# Altium schematic sheet Brightside_Telemetry_power_rev2.SchDoc
size A4
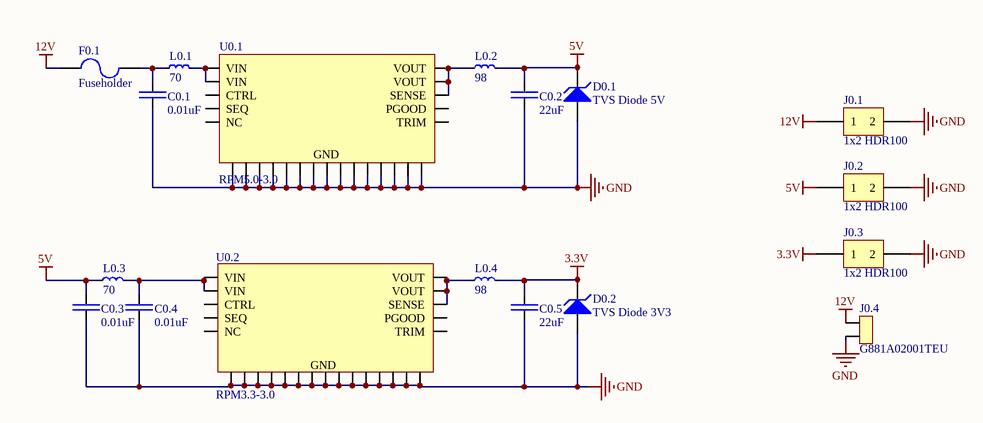
[diagram p0: Brightside_Telemetry_power_rev2.SchDoc]

## Parts
C0.1  0.01uF  [0805]
C0.2  22uF  [1206]
C0.3  0.01uF  [0805]
C0.4  0.01uF  [0805]
C0.5  22uF  [1206]
D0.1  TVS Diode 5V  [SOD-323]
D0.2  TVS Diode 3V3  [SOD-323]
F0.1  Fuseholder  [SCHURTER - 0031.7701.11 - FUSE HOLDER, PCB MOUNT]
J0.1  1x2 HDR100  [Molex 0901200762]
J0.2  1x2 HDR100  [Molex 0901200762]
J0.3  1x2 HDR100  [Molex 0901200762]
J0.4  G881A02001TEU  [Micro-Fit 3.0 2pos]
L0.1  70  [1812]
L0.2  98  [7427932]
L0.3  70  [1812]
L0.4  98  [7427932]
U0.1  RPM5.0-3.0  [25-BLGA]
U0.2  RPM3.3-3.0  [25-BLGA]

## Nets
3.3V: C0.5.2 D0.2.2(K) J0.3.1 L0.4.2
5V: C0.2.2 C0.3.2 D0.1.2(K) J0.2.1 L0.2.2 L0.3.1
12V: F0.1.1 J0.1.1 J0.4.1
GND: C0.1.1 C0.2.1 C0.3.1 C0.4.1 C0.5.1 D0.1.1(A) D0.2.1(A) J0.1.2 J0.2.2 J0.3.2 J0.4.2 U0.1.A3(GND) U0.1.A4(GND) U0.1.B1(GND) U0.1.B2(GND) U0.1.B3(GND) U0.1.B4(GND) U0.1.C2(GND) U0.1.C3(GND) U0.1.C4(GND) U0.1.D2(GND) U0.1.D3(GND) U0.1.D4(GND) U0.1.D5(GND) U0.1.E3(GND) U0.1.E4(GND) U0.2.A3(GND) U0.2.A4(GND) U0.2.B1(GND) U0.2.B2(GND) U0.2.B3(GND) U0.2.B4(GND) U0.2.C2(GND) U0.2.C3(GND) U0.2.C4(GND) U0.2.D2(GND) U0.2.D3(GND) U0.2.D4(GND) U0.2.D5(GND) U0.2.E3(GND) U0.2.E4(GND)
NetC0.1_2: C0.1.2 F0.1.2 L0.1.1
NetC0.4_2: C0.4.2 L0.3.2 U0.2.A1(VIN) U0.2.A2(VIN)
NetL0.1_2: L0.1.2 U0.1.A1(VIN) U0.1.A2(VIN)
NetL0.2_1: L0.2.1 U0.1.A5(VOUT) U0.1.B5(VOUT) U0.1.C5(SENSE)
NetL0.4_1: L0.4.1 U0.2.A5(VOUT) U0.2.B5(VOUT) U0.2.C5(SENSE)

Not connected (* = marked no-connect by the designer): U0.1 C1(CTRL) D1(PGOOD) E1(SEQ) E2(NC) E5(TRIM); U0.2 C1(CTRL) D1(PGOOD) E1(SEQ) E2(NC) E5(TRIM)

## Library data of the parts
C0.1 C0.3 C0.4 = C0805C103K1RAC7210: Cap Ceramic 0.01uF 100V X7R 10% SMD 0805 125C T/R; Manufacturer: KEMET; Capacitance: 10nF; Supplier 1: Digi-Key; Supplier Part Number 1: 399-17617-1-ND; Manufacturer Part Number: C0805C103K1RAC7210; RoHS: Yes; Category: Ceramic Capacitors; Stock 1: 43378; Mount: Surface Mount; Case/Package: 0805; Case Code (Imperial): 0805; Case Code (Metric): 2012; Dielectric Material: Ceramic; Min Operating Temperature: -55°C; Max Operating Temperature: 125°C; Dielectric: X7R; Tolerance: 10%; Termination: SMD/SMT; Packaging: Tape and Reel; Package Quantity: 10000; Voltage Rating: 100V; Voltage Rating (DC): 100V; Length: 2mm; Height: 0.78mm; Depth: 1.25mm; Radiation Hardening: No; ComponentLink1URL: http://www.mouser.com/ds/2/212/KEM_C1002_X7R_SMD-1102033.pdf?src-supplier=Mouser; ComponentLink1Description: http://www.mouser.com/ds/2/212/KEM_C1002_X7R_SMD-1102033.pdf?src-supplier=Mouser; ComponentLink2URL: https://www.verical.com/server-webapp/html/getDatasheet?partID=131027&src-supplier=Verical; ComponentLink2Description: https://www.verical.com/server-webapp/html/getDatasheet?partID=131027&src-supplier=Verical; ComponentLink3URL: http://components.arrow.com/part/dataview/0323_00324583?src-supplier=Arrow+Europe; ComponentLink3Description: http://components.arrow.com/part/dataview/0323_00324583?src-supplier=Arrow+Europe; ComponentLink4URL: http://www.farnell.com/datasheets/2747800.pdf?src-supplier=Farnell; ComponentLink4Description: http://www.farnell.com/datasheets/2747800.pdf?src-supplier=Farnell; ComponentLink5URL: http://components.arrow.com/part/dataview/2091052S6675795N7429?src-supplier=Arrow; ComponentLink5Description: http://components.arrow.com/part/dataview/2091052S6675795N7429?src-supplier=Arrow; ComponentLink6URL: http://www.farnell.com/datasheets/2747800.pdf?src-supplier=Newark; ComponentLink6Description: http://www.farnell.com/datasheets/2747800.pdf?src-supplier=Newark; ComponentLink7URL: http://www.kemet.com/kemet/web/homepage/kechome.nsf/weben/C4DA2DA1D1C9D3C3CA2570A50016092D/$file/KEM_C1002_X7R_SMD.pdf?src-supplier=Avnet+Europe; ComponentLink7Description: http://www.kemet.com/kemet/web/homepage/kechome.nsf/weben/C4DA2DA1D1C9D3C3CA2570A50016092D/$file/KEM_C1002_X7R_SMD.pdf?src-supplier=Avnet+Europe; ComponentLink8URL: http://www.kemet.com/kemet/web/homepage/kechome.nsf/weben/C4DA2DA1D1C9D3C3CA2570A50016092D/$file/KEM_C1002_X7R_SMD.pdf?src-supplier=Avnet; ComponentLink8Description: http://www.kemet.com/kemet/web/homepage/kechome.nsf/weben/C4DA2DA1D1C9D3C3CA2570A50016092D/$file/KEM_C1002_X7R_SMD.pdf?src-supplier=Avnet; ComponentLink9URL: https://api.kemet.com/component-edge/download/datasheet/C0805C103K1RAC7210.pdf?src-supplier=Digi-Key; ComponentLink9Description: https://api.kemet.com/component-edge/download/datasheet/C0805C103K1RAC7210.pdf?src-supplier=Digi-Key
C0.2 C0.5 = CL31B226KPHNNNE: CAP CER 22UF 10V X7R 1206; Manufacturer: Samsung; Tolerance: 10%; Supplier 1: Digi-Key; Supplier Part Number 1: 1276-2769-1-ND; Manufacturer Part Number: CL31B226KPHNNNE; RoHS: Yes; Category: Ceramic Capacitors; Stock 1: 617814; Mount: Surface Mount; Case/Package: 1206; Case Code (Metric): 3216; Case Code (Imperial): 1206; Contact Plating: Tin; Min Operating Temperature: -55°C; Max Operating Temperature: 125°C; Package Quantity: 2000; Packaging: Tape and Reel; Capacitance: 22uF; Voltage Rating: 10V; Dielectric: X7R; Voltage Rating (DC): 10V; Termination: Wraparound; Length: 3.2mm; Thickness: 0.071inch; Width: 0.063inch; Depth: 1.6mm; Radiation Hardening: No; Lead Free: Lead Free; ComponentLink1URL: https://datasheet.ciiva.com/25724/cl31b226kphnnne-25724443.pdf?src-supplier=Digi-Key; ComponentLink1Description: https://datasheet.ciiva.com/25724/cl31b226kphnnne-25724443.pdf?src-supplier=Digi-Key; ComponentLink2URL: https://datasheet.ciiva.com/16384/cl31b226kphnnne-16384588.pdf?src-supplier=Future+Electronics; ComponentLink2Description: https://datasheet.ciiva.com/16384/cl31b226kphnnne-16384588.pdf?src-supplier=Future+Electronics; ComponentLink3URL: https://datasheet.ciiva.com/26838/getdatasheetpartid-710483-26838941.pdf?src-supplier=Verical; ComponentLink3Description: https://datasheet.ciiva.com/26838/getdatasheetpartid-710483-26838941.pdf?src-supplier=Verical
D0.1 = SD05T1G: TVS DIODE 5V 9.8V SOD323; Manufacturer: ON Semiconductor; Capacitance: 350pF; Direction: Unidirectional; Clamping Voltage: 14.5V; Peak Pulse Power: 350W; Number of Unidirectional Channels: 1; Min Breakdown Voltage: 6.2V; Power Line Protection: No; Peak Pulse Current: 24A; Element Configuration: Single; Breakdown Voltage: 6.75V; Leakage Current: 10uA; Max Breakdown Voltage: 7.3V; Test Current: 1mA; ESD Protection: Yes; Max Power Dissipation: 200mW; Supplier 1: Digi-Key; Supplier Part Number 1: SD05T1GOSCT-ND; Manufacturer Part Number: SD05T1G; Stock 1: 61559; Pricing 1: 1 = 0.49000, 10 = 0.36500, 100 = 0.20680, 500 = 0.13698, 1000 = 0.10502 (USD); RoHS: Yes; Case/Package: SOD-323-2; Number of Pins: 2; Contact Plating: Tin; Min Operating Temperature: -55°C; Max Operating Temperature: 150°C; Packaging: Tape and Reel; Reverse Standoff Voltage: 5V; Working Voltage: 5V; Composition: Zener; Package Quantity: 1; Operating Supply Voltage: 5V; Max Surge Current: 24A; Number of Elements: 1; Reverse Breakdown Voltage: 6.2V; Polarity: Unidirectional; Termination: SMD/SMT; Power Dissipation: 350W; Max Reverse Leakage Current: 10uA; Voltage Rating (DC): 5V; Max Output Current: 24A; Length: 1.7mm; Height: 1mm; Width: 1.35mm; Depth: 1.25mm; Radiation Hardening: No; Lead Free: Lead Free; REACH SVHC: No SVHC; ComponentLink1URL: https://datasheet.ciiva.com/4507/sd05t1-d-241634-4507873.pdf?src-supplier=Mouser; ComponentLink1Description: https://datasheet.ciiva.com/4507/sd05t1-d-241634-4507873.pdf?src-supplier=Mouser; ComponentLink2URL: https://datasheet.ciiva.com/16200/sd05t1-d-16200994.pdf?src-supplier=Future+Electronics; ComponentLink2Description: https://datasheet.ciiva.com/16200/sd05t1-d-16200994.pdf?src-supplier=Future+Electronics; ComponentLink3URL: https://datasheet.ciiva.com/15143/getdatasheetpartid-117154-15143559.pdf?src-supplier=Verical; ComponentLink3Description: https://datasheet.ciiva.com/15143/getdatasheetpartid-117154-15143559.pdf?src-supplier=Verical; ComponentLink4URL: https://datasheet.ciiva.com/30478/0900766b81250bd7-30478714.pdf?src-supplier=RSComponents; ComponentLink4Description: https://datasheet.ciiva.com/30478/0900766b81250bd7-30478714.pdf?src-supplier=RSComponents; ComponentLink5URL: https://datasheet.ciiva.com/339/sd05t1-d-339830.pdf?src-supplier=Digi-Key; ComponentLink5Description: https://datasheet.ciiva.com/339/sd05t1-d-339830.pdf?src-supplier=Digi-Key; ComponentLink6URL: https://datasheet.ciiva.com/339/sd05t1-d-339831.pdf?src-supplier=Digi-Key; ComponentLink6Description: https://datasheet.ciiva.com/339/sd05t1-d-339831.pdf?src-supplier=Digi-Key; ComponentLink7URL: https://datasheet.ciiva.com/11193/sd05t1-d-11193467.pdf?src-supplier=Avnet; ComponentLink7Description: https://datasheet.ciiva.com/11193/sd05t1-d-11193467.pdf?src-supplier=Avnet; ComponentLink8URL: https://datasheet.ciiva.com/22637/1878253-22637228.pdf?src-supplier=Element14; ComponentLink8Description: https://datasheet.ciiva.com/22637/1878253-22637228.pdf?src-supplier=Element14; ComponentLink9URL: https://datasheet.ciiva.com/25956/sd05t1-d-25956638.pdf?src-supplier=Avnet+Europe; ComponentLink9Description: https://datasheet.ciiva.com/25956/sd05t1-d-25956638.pdf?src-supplier=Avnet+Europe; Category: Circuit Protection
D0.2 = CDSOD323-T03S: ESD Suppressor TVS ±30kV 2-Pin SOD-323 T/R; Manufacturer: Bourns; Direction: Unidirectional; Operating Supply Voltage: 3.3V; Max Surge Current: 43A; Capacitance: 500pF; Number of Unidirectional Channels: 1; Min Breakdown Voltage: 4V; Clamping Voltage: 10.9V; Peak Pulse Power: 500W; Power Line Protection: No; Leakage Current: 125uA; Element Configuration: Single; Supplier 1: Digi-Key; Supplier Part Number 1: CDSOD323-T03SCT-ND; Manufacturer Part Number: CDSOD323-T03S; Stock 1: 99362; Pricing 1: 1 = 0.72000, 10 = 0.60600, 25 = 0.53000, 100 = 0.45420, 250 = 0.39368, 500 = 0.33310, 1000 = 0.25740 (USD); RoHS: Yes; Mount: Surface Mount; Case/Package: SOD-323-2; Number of Pins: 2; Contact Plating: Tin; Min Operating Temperature: -55°C; Max Operating Temperature: 150°C; Packaging: Tape and Reel; Package Quantity: 3000; Reverse Standoff Voltage: 3.3V; Polarity: Unidirectional; Number of Channels: 1; Breakdown Voltage: 4V; Termination: SMD/SMT; Working Voltage: 3.3V; Max Power Dissipation: 500W; Peak Pulse Current: 43A; Composition: Zener; Length: 1.9mm; Depth: 1.45mm; Radiation Hardening: No; REACH SVHC: No SVHC; ComponentLink1URL: https://datasheet.ciiva.com/22685/1671000-22685541.pdf?src-supplier=Element14; ComponentLink1Description: https://datasheet.ciiva.com/22685/1671000-22685541.pdf?src-supplier=Element14; ComponentLink2URL: https://datasheet.ciiva.com/6575/cdsod323-txxsc-6575941.pdf?src-supplier=Digi-Key; ComponentLink2Description: https://datasheet.ciiva.com/6575/cdsod323-txxsc-6575941.pdf?src-supplier=Digi-Key; ComponentLink3URL: https://datasheet.ciiva.com/11193/cdsod323-txxsc-11193742.pdf?src-supplier=Avnet; ComponentLink3Description: https://datasheet.ciiva.com/11193/cdsod323-txxsc-11193742.pdf?src-supplier=Avnet; Category: Circuit Protection
F0.1 = 0031.7701.11: SCHURTER - 0031.7701.11 - FUSE HOLDER, PCB MOUNT; Color: White; Material: Tin; Body Material: Thermoplastic; Current Rating: 5A; Voltage Rating (AC): 125V; Number of Poles: 1; Illumination Type: Illuminated; Supplier 1: Digi-Key; Supplier Part Number 1: 486-1991-ND; Manufacturer: Schurter; Manufacturer Part Number: 0031.7701.11; Stock 1: 11381; Pricing 1: 1 = 1.39000, 50 = 1.03400, 100 = 0.93100, 500 = 0.70300, 1000 = 0.52080 (USD); RoHS: Yes; Mount: Surface Mount; Weight: 0.016932oz; Contact Material: Copper Alloy; Contact Plating: Tin; Terminal Material: Brass; Min Operating Temperature: -40°C; Max Operating Temperature: 85°C; Package Quantity: 100; Packaging: Bulk; Voltage Rating: 125V; Number of Circuits: 1; Termination: SMD/SMT; Voltage: 125V; Fuse Current: 5A; Voltage Rating (DC): 125V; Length: 12mm; Height: 6mm; Width: 5.2mm; Depth: 5.2mm; Radiation Hardening: No; REACH SVHC: No SVHC; Lead Free: Lead Free; ComponentLink1URL: https://datasheet.ciiva.com/1270/typ-omh-125-1270896.pdf?src-supplier=Element14; ComponentLink1Description: https://datasheet.ciiva.com/1270/typ-omh-125-1270896.pdf?src-supplier=Element14; ComponentLink2URL: https://datasheet.ciiva.com/7496/typ-omh-125-7496724.pdf?src-supplier=Digi-Key; ComponentLink2Description: https://datasheet.ciiva.com/7496/typ-omh-125-7496724.pdf?src-supplier=Digi-Key; ComponentLink3URL: https://datasheet.ciiva.com/16215/typ-omh-125-16215096.pdf?src-supplier=Onlinecomponents.com; ComponentLink3Description: https://datasheet.ciiva.com/16215/typ-omh-125-16215096.pdf?src-supplier=Onlinecomponents.com; ComponentLink4URL: https://datasheet.ciiva.com/30058/73typ-omh-125-30058618.pdf?src-supplier=Onlinecomponents.com; ComponentLink4Description: https://datasheet.ciiva.com/30058/73typ-omh-125-30058618.pdf?src-supplier=Onlinecomponents.com; ComponentLink5URL: https://datasheet.ciiva.com/14128/awomh125-data-e-14128364.pdf?src-supplier=Distrelec; ComponentLink5Description: https://datasheet.ciiva.com/14128/awomh125-data-e-14128364.pdf?src-supplier=Distrelec; ComponentLink6URL: https://datasheet.ciiva.com/1221/1925349-1221826.pdf?src-supplier=Newark; ComponentLink6Description: https://datasheet.ciiva.com/1221/1925349-1221826.pdf?src-supplier=Newark; ComponentLink7URL: https://datasheet.ciiva.com/3014/typ-omh-125-3014522.pdf?src-supplier=Avnet; ComponentLink7Description: https://datasheet.ciiva.com/3014/typ-omh-125-3014522.pdf?src-supplier=Avnet; ComponentLink8URL: https://datasheet.ciiva.com/4480/typ-omh-125-4480427.pdf?src-supplier=Mouser; ComponentLink8Description: https://datasheet.ciiva.com/4480/typ-omh-125-4480427.pdf?src-supplier=Mouser; ComponentLink9URL: https://datasheet.ciiva.com/17405/typ-omh-125-17405484.pdf?src-supplier=Avnet+Europe; ComponentLink9Description: https://datasheet.ciiva.com/17405/typ-omh-125-17405484.pdf?src-supplier=Avnet+Europe; Category: Circuit Protection; ComponentLink10Description: Digikey; ComponentLink10URL: https://www.digikey.ca/product-detail/en/schurter-inc/0031.7701.11/486-1991-ND/640027
J0.1-J0.3 = 0901200762: CONN HEADER VERT 2POS 2.54MM; Manufacturer: Molex; Number of Positions: 2; Connector Type: Male Pin; Contact Resistance: 20mR; Max Voltage Rating (DC): 350V; Gender: Male; Supplier 1: Digi-Key; Supplier Part Number 1: WM8084-ND; Manufacturer Part Number: 0901200762; Stock 1: 37733; Pricing 1: 1 = 0.560000, 10 = 0.530000, 100 = 0.406000, 500 = 0.353000, 1000 = 0.291230, 5000 = 0.255930, 10000 = 0.238280 (USD); RoHS: Yes; Mount: Through Hole; Color: Black; Housing Color: Black; Housing Material: Polyester; Contact Plating: Gold; Contact Material: Brass; Min Operating Temperature: -55°C; Max Operating Temperature: 125°C; Packaging: Bulk; Number of Rows: 1; Termination: Solder; Number of Contacts: 2; Orientation: Straight; Max Voltage Rating (AC): 350V; Length: 5.08mm; Pitch: 2.54mm; Depth: 2.54mm; Contact Mating Length: 0.266inch; ComponentLink1URL: https://datasheet.ciiva.com/711/901200762-sd-711939.pdf?src-supplier=Digi-Key; ComponentLink1Description: https://datasheet.ciiva.com/711/901200762-sd-711939.pdf?src-supplier=Digi-Key; ComponentLink2URL: https://datasheet.ciiva.com/3117/0901200762-pcb-headers-3117809.pdf?src-supplier=Avnet; ComponentLink2Description: https://datasheet.ciiva.com/3117/0901200762-pcb-headers-3117809.pdf?src-supplier=Avnet; Category: Connectors
J0.4 = G881A02001TEU: Micro-fit 3.0 2pos right-angle; Manufacturer: Molex; Manufacturer Part Number: 0430450200; Number of Positions: 2; Contact Resistance: 10mR; Max Voltage Rating (AC): 250V; Connector Type: Male Pin; Row Spacing: 0.118inch; Pitch: 3mm; Supplier 1: Digi-Key; Supplier Part Number 1: WM1813-ND; RoHS: Yes; Category: Headers and Wire Housings; Stock 1: 9248; Mount: Through Hole; Contact Plating: Tin; Color: Black; Contact Material: Brass; Housing Material: Polymer; Housing Color: Black; Min Operating Temperature: -40°C; Max Operating Temperature: 105°C; Termination: Solder; Number of Contacts: 2; Packaging: Tray; Number of Rows: 2; Orientation: Right Angle; Fastening Type: Ramp; Length: 7.15mm; Depth: 12.2mm; Flammability Rating: UL94 V-0; ComponentLink1URL: https://datasheet.ciiva.com/712/430450200-sd-712017.pdf?src-supplier=Digi-Key; ComponentLink1Description: https://datasheet.ciiva.com/712/430450200-sd-712017.pdf?src-supplier=Digi-Key; ComponentLink2URL: https://datasheet.ciiva.com/3933/159670430450200-pcb-headers-3933176.pdf?src-supplier=Arrow; ComponentLink2Description: https://datasheet.ciiva.com/3933/159670430450200-pcb-headers-3933176.pdf?src-supplier=Arrow
L0.1 L0.3 = 742792510: WURTH ELEKTRONIK - 742792510 - FERRITE BEAD, 70R, 6A, 1812; Manufacturer: Wurth Electronics; Max DC Current: 3mA; DC Resistance (DCR): 30mR; Test Frequency: 100MHz; Number of Lines: 1; Tolerance: 25%; Supplier 1: Digi-Key; Supplier Part Number 1: 732-1640-1-ND; Manufacturer Part Number: 742792510; RoHS: Yes; Category: Ferrite Beads and Chips; Stock 1: 5974; Mount: Surface Mount; Case/Package: SMD/SMT; Weight: 0.003951oz; Case Code (Imperial): 1812; Case Code (Metric): 4532; Material: Ferrite; Min Operating Temperature: -55°C; Max Operating Temperature: 125°C; Max Current Rating: 6A; Termination: SMD/SMT; Package Quantity: 1; Packaging: Tape and Reel; Current Rating: 6A; Impedance: 70R; Resistance: 30mR; Length: 4.5mm; Height: 1.5mm; Depth: 3.2mm; Width: 3.2mm; Lead Free: Lead Free; REACH SVHC: Unknown; ComponentLink1URL: https://datasheet.ciiva.com/1475/1695992-1475250.pdf?src-supplier=Farnell; ComponentLink1Description: https://datasheet.ciiva.com/1475/1695992-1475250.pdf?src-supplier=Farnell; ComponentLink2URL: https://datasheet.ciiva.com/11803/0900766b80bbd134-11803157.pdf?src-supplier=RSComponents; ComponentLink2Description: https://datasheet.ciiva.com/11803/0900766b80bbd134-11803157.pdf?src-supplier=RSComponents; ComponentLink3URL: https://datasheet.ciiva.com/23762/742792510-23762981.pdf?src-supplier=Newark; ComponentLink3Description: https://datasheet.ciiva.com/23762/742792510-23762981.pdf?src-supplier=Newark; ComponentLink4URL: https://datasheet.ciiva.com/4940/742792510-72179-4940456.pdf?src-supplier=Mouser; ComponentLink4Description: https://datasheet.ciiva.com/4940/742792510-72179-4940456.pdf?src-supplier=Mouser; ComponentLink5URL: https://datasheet.ciiva.com/1013/742792510-1013644.pdf?src-supplier=Digi-Key; ComponentLink5Description: https://datasheet.ciiva.com/1013/742792510-1013644.pdf?src-supplier=Digi-Key; ComponentLink6URL: https://datasheet.ciiva.com/1013/742792510-1013645.pdf?src-supplier=Digi-Key; ComponentLink6Description: https://datasheet.ciiva.com/1013/742792510-1013645.pdf?src-supplier=Digi-Key; ComponentLink7URL: https://datasheet.ciiva.com/1126/1695992-1126824.pdf?src-supplier=Element14; ComponentLink7Description: https://datasheet.ciiva.com/1126/1695992-1126824.pdf?src-supplier=Element14; ComponentLink8URL: https://datasheet.ciiva.com/1013/742792510-1013646.pdf?src-supplier=Digi-Key; ComponentLink8Description: https://datasheet.ciiva.com/1013/742792510-1013646.pdf?src-supplier=Digi-Key
L0.2 L0.4 = 7427932: Ferrite Bead 98 Ohm 2SMD 1LN; Manufacturer: Wurth Electronics; DC Resistance (DCR): 0.9mR; Max DC Current: 6A; Tolerance: 25%; Shielding: Unshielded; Number of Lines: 1; Test Frequency: 100MHz; Impedance: 98R; Supplier 1: Digi-Key; Supplier Part Number 1: 732-2394-1-ND; Manufacturer Part Number: 7427932; RoHS: Yes; Category: Ferrite Beads and Chips; Stock 1: 698; Mount: Surface Mount; Case/Package: SMD/SMT; Case Code (Metric): 4532; Case Code (Imperial): 1812; Min Operating Temperature: -55°C; Max Operating Temperature: 125°C; Termination: SMD/SMT; Package Quantity: 1; Packaging: Tape and Reel; Max Current Rating: 6A; Length: 7.8mm; Height: 3mm; Depth: 4.75mm; Width: 0.187inch; REACH SVHC: Unknown; ComponentLink1URL: https://datasheet.ciiva.com/1014/7427932-1014097.pdf?src-supplier=Digi-Key; ComponentLink1Description: https://datasheet.ciiva.com/1014/7427932-1014097.pdf?src-supplier=Digi-Key; ComponentLink2URL: https://datasheet.ciiva.com/1466/1696119-1466626.pdf?src-supplier=Element14; ComponentLink2Description: https://datasheet.ciiva.com/1466/1696119-1466626.pdf?src-supplier=Element14; ComponentLink3URL: https://datasheet.ciiva.com/11796/0900766b80f886b0-11796146.pdf?src-supplier=RSComponents; ComponentLink3Description: https://datasheet.ciiva.com/11796/0900766b80f886b0-11796146.pdf?src-supplier=RSComponents; ComponentLink4URL: https://datasheet.ciiva.com/23763/7427932-23763047.pdf?src-supplier=Newark; ComponentLink4Description: https://datasheet.ciiva.com/23763/7427932-23763047.pdf?src-supplier=Newark; ComponentLink5URL: https://datasheet.ciiva.com/4939/7427932-72413-4939403.pdf?src-supplier=Mouser; ComponentLink5Description: https://datasheet.ciiva.com/4939/7427932-72413-4939403.pdf?src-supplier=Mouser; ComponentLink6URL: https://datasheet.ciiva.com/1014/7427932-1014098.pdf?src-supplier=Digi-Key; ComponentLink6Description: https://datasheet.ciiva.com/1014/7427932-1014098.pdf?src-supplier=Digi-Key; ComponentLink7URL: https://datasheet.ciiva.com/1014/7427932-1014099.pdf?src-supplier=Digi-Key; ComponentLink7Description: https://datasheet.ciiva.com/1014/7427932-1014099.pdf?src-supplier=Digi-Key; ComponentLink8URL: https://datasheet.ciiva.com/22711/1696119-22711445.pdf?src-supplier=Element14; ComponentLink8Description: https://datasheet.ciiva.com/22711/1696119-22711445.pdf?src-supplier=Element14
U0.1 = RPM5.0-3.0: DC-DC Converter; SMD; reg; Single Output; 3A; 5V Out; RPM-3.0 Series; Manufacturer: Recom; Supplier 1: Digi-Key; Manufacturer Part Number: RPM5.0-3.0; RoHS: No; Category: Voltage Regulators - Switching; Stock 1: 929; Pricing 1: 1=4.26000 (USD); ComponentLink1URL: http://www.farnell.com/datasheets/2787803.pdf?src-supplier=Farnell; ComponentLink1Description: http://www.farnell.com/datasheets/2787803.pdf?src-supplier=Farnell; ComponentLink2URL: https://www.recom-power.com/pdf/Innoline/RPM-3.0.pdf?src-supplier=Digi-Key; ComponentLink2Description: https://www.recom-power.com/pdf/Innoline/RPM-3.0.pdf?src-supplier=Digi-Key; Supplier Part Number 1: 945-3254-1-ND
U0.2 = RPM3.3-3.0: RPM-3.0 Series 3 to 17 V Input 3.3 V Output 3 A Non Isolated DC/DC Converter; Manufacturer: Recom; Supplier 1: Digi-Key; Manufacturer Part Number: RPM3.3-3.0; RoHS: No; Category: Voltage Regulators - Switching; Stock 1: 287; Pricing 1: 1=4.26000 (USD); ComponentLink1URL: https://www.recom-power.com/pdf/Innoline/RPM-3.0.pdf?src-supplier=Digi-Key; ComponentLink1Description: https://www.recom-power.com/pdf/Innoline/RPM-3.0.pdf?src-supplier=Digi-Key; Supplier Part Number 1: 945-3253-1-ND